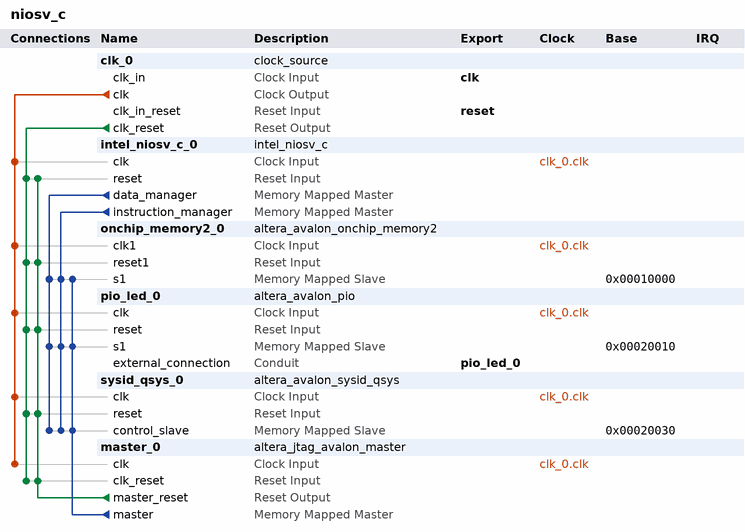
[diagram p0: system contents]
# Platform Designer (Qsys) system niosv_c, MAX 10 10M50DAF484C7G
# Parameters at their usual value, and those the tool derives, are not listed.
package require -exact qsys 25.1
create_system niosv_c
set_project_property DEVICE_FAMILY {MAX 10}
set_project_property DEVICE 10M50DAF484C7G

add_instance clk_0 clock_source 25.1
set_instance_parameter_value clk_0 clockFrequency 50000000

add_instance intel_niosv_c_0 intel_niosv_c 4.1.0
set_instance_parameter_value intel_niosv_c_0 archSize 32
set_instance_parameter_value intel_niosv_c_0 clockFrequency 50000000
set_instance_parameter_value intel_niosv_c_0 enableAvalonInterface true
set_instance_parameter_value intel_niosv_c_0 enableECCLite false
set_instance_parameter_value intel_niosv_c_0 enableResetReq false
set_instance_parameter_value intel_niosv_c_0 hartID 0
set_instance_parameter_value intel_niosv_c_0 numGpr 32
set_instance_parameter_value intel_niosv_c_0 resetOffset 0
set_instance_parameter_value intel_niosv_c_0 resetSlave onchip_memory2_0.s1
set_instance_parameter_value intel_niosv_c_0 useResetReq false

add_instance onchip_memory2_0 altera_avalon_onchip_memory2 25.1
set_instance_parameter_value onchip_memory2_0 dataWidth 32
set_instance_parameter_value onchip_memory2_0 dualPort false
set_instance_parameter_value onchip_memory2_0 initMemContent false
set_instance_parameter_value onchip_memory2_0 initializationFileName onchip_mem.hex
set_instance_parameter_value onchip_memory2_0 memorySize 65536

add_instance pio_led_0 altera_avalon_pio 25.1
set_instance_parameter_value pio_led_0 direction Output
set_instance_parameter_value pio_led_0 resetValue 3
set_instance_parameter_value pio_led_0 width 4

add_instance sysid_qsys_0 altera_avalon_sysid_qsys 25.1
set_instance_parameter_value sysid_qsys_0 id 0

add_instance master_0 altera_jtag_avalon_master 25.1

# connections
add_connection clk_0.clk intel_niosv_c_0.clk clock
add_connection clk_0.clk master_0.clk clock
add_connection clk_0.clk onchip_memory2_0.clk1 clock
add_connection clk_0.clk pio_led_0.clk clock
add_connection clk_0.clk sysid_qsys_0.clk clock
add_connection clk_0.clk_reset intel_niosv_c_0.reset reset
add_connection clk_0.clk_reset master_0.clk_reset reset
add_connection clk_0.clk_reset onchip_memory2_0.reset1 reset
add_connection clk_0.clk_reset pio_led_0.reset reset
add_connection clk_0.clk_reset sysid_qsys_0.reset reset
add_connection master_0.master_reset intel_niosv_c_0.reset reset
add_connection master_0.master_reset master_0.clk_reset reset
add_connection master_0.master_reset onchip_memory2_0.reset1 reset
add_connection master_0.master_reset pio_led_0.reset reset
add_connection master_0.master_reset sysid_qsys_0.reset reset
add_connection intel_niosv_c_0.data_manager onchip_memory2_0.s1 avalon
set_connection_parameter_value intel_niosv_c_0.data_manager/onchip_memory2_0.s1 baseAddress 0x00010000
add_connection intel_niosv_c_0.data_manager pio_led_0.s1 avalon
set_connection_parameter_value intel_niosv_c_0.data_manager/pio_led_0.s1 baseAddress 0x00020010
add_connection intel_niosv_c_0.data_manager sysid_qsys_0.control_slave avalon
set_connection_parameter_value intel_niosv_c_0.data_manager/sysid_qsys_0.control_slave baseAddress 0x00020030
add_connection intel_niosv_c_0.instruction_manager onchip_memory2_0.s1 avalon
set_connection_parameter_value intel_niosv_c_0.instruction_manager/onchip_memory2_0.s1 baseAddress 0x00010000
add_connection intel_niosv_c_0.instruction_manager pio_led_0.s1 avalon
set_connection_parameter_value intel_niosv_c_0.instruction_manager/pio_led_0.s1 baseAddress 0x00020010
add_connection intel_niosv_c_0.instruction_manager sysid_qsys_0.control_slave avalon
set_connection_parameter_value intel_niosv_c_0.instruction_manager/sysid_qsys_0.control_slave baseAddress 0x00020030
add_connection master_0.master onchip_memory2_0.s1 avalon
set_connection_parameter_value master_0.master/onchip_memory2_0.s1 baseAddress 0x00010000
add_connection master_0.master pio_led_0.s1 avalon
set_connection_parameter_value master_0.master/pio_led_0.s1 baseAddress 0x00020010
add_connection master_0.master sysid_qsys_0.control_slave avalon
set_connection_parameter_value master_0.master/sysid_qsys_0.control_slave baseAddress 0x00020030

# exported interfaces
add_interface clk clock sink
set_interface_property clk EXPORT_OF clk_0.clk_in
add_interface pio_led_0 conduit end
set_interface_property pio_led_0 EXPORT_OF pio_led_0.external_connection
add_interface reset reset sink
set_interface_property reset EXPORT_OF clk_0.clk_in_reset

set_interconnect_requirement {$system} qsys_mm.clockCrossingAdapter HANDSHAKE
set_interconnect_requirement {$system} qsys_mm.enableEccProtection FALSE
set_interconnect_requirement {$system} qsys_mm.insertDefaultSlave FALSE
set_interconnect_requirement {$system} qsys_mm.maxAdditionalLatency 1

save_system niosv_c.qsys
